# Altium schematic sheet 1.3.1_Power_board_BAT1&BAT2.SchDoc
size A4; DocumentNumber: 12; SheetNumber: 12; SheetTotal: 14
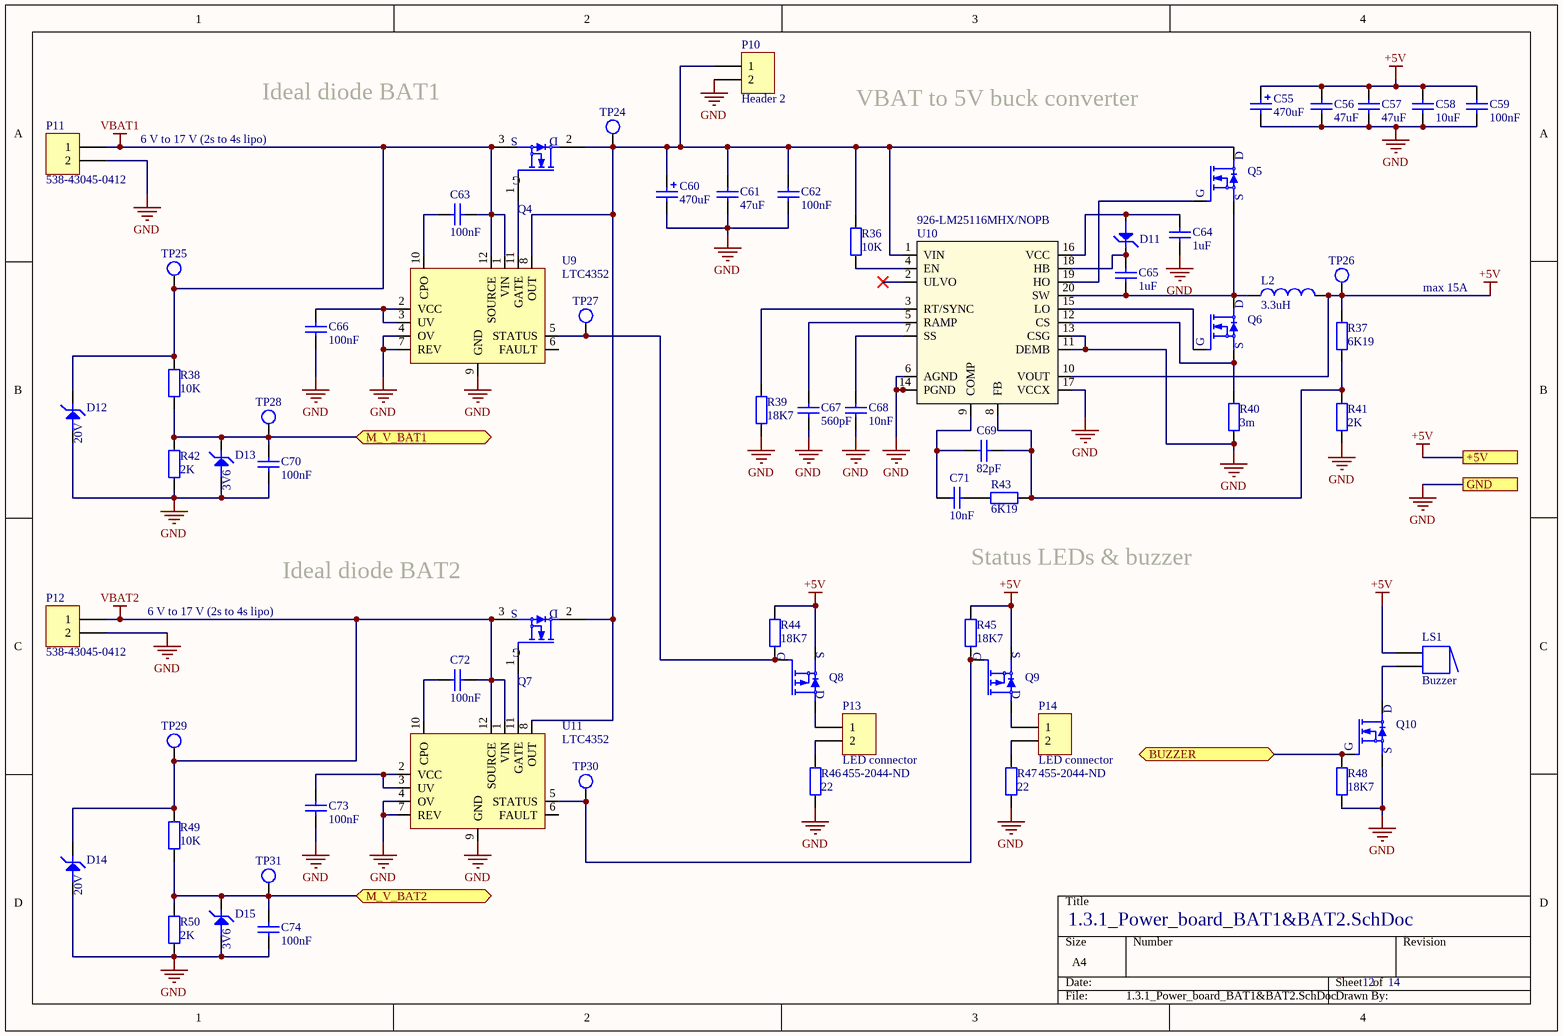
[diagram p0: 1.3.1_Power_board_BAT1&BAT2.SchDoc]

## Parts
C55  470uF  [PCV_10x10]
C56  47uF  [CAP1206W]
C57  47uF  [CAP1206W]
C58  10uF  [CAP0805W]
C59  100nF  [CAP0603R]
C60  470uF  [PCV_10x10]
C61  47uF  [CAP1206W]
C62  100nF  [CAP0603R]
C63  100nF  [CAP0603R]
C64  1uF  [CAP0603R]
C65  1uF  [CAP0603R]
C66  100nF  [CAP0603R]
C67  560pF  [CAP0603R]
C68  10nF  [CAP0603R]
C69  82pF  [CAP0603R]
C70  100nF  [CAP0603R]
C71  10nF  [CAP0603R]
C72  100nF  [CAP0603R]
C73  100nF  [CAP0603R]
C74  100nF  [CAP0603R]
D11  DS_NRVB0530T3G  [SOD123]  (value not drawn)
D12  20V  [DO-214AA]
D13  3V6  [SOT23]
D14  20V  [DO-214AA]
D15  3V6  [SOT23]
L2  3.3uH  [IHLP_Inductor]
LS1  Buzzer  [CT-1205C-SMT]
P10  Header 2  [Con Prov 2P Power]
P11  Supplier Part Number 1: 538-43045-0412  [Con 2P Power and MicroFit 4P]  (hidden comment: Header MicroFit 2)
P12  Supplier Part Number 1: 538-43045-0412  [Con 2P Power and MicroFit 4P]  (hidden comment: Header MicroFit 2)
P13  LED connector  Supplier Part Number 1: 455-2044-ND  [CON_JST_XA_ S02B-XASS-1]
P14  LED connector  Supplier Part Number 1: 455-2044-ND  [CON_JST_XA_ S02B-XASS-1]
Q4  MOSFET_N  [TO220]  (value not drawn)
Q5  MOSFET_N  [TO252]  (value not drawn)
Q6  MOSFET_N  [TO252]  (value not drawn)
Q7  MOSFET_N  [TO220]  (value not drawn)
Q8  MOSFET_P  [SOT23]  (value not drawn)
Q9  MOSFET_P  [SOT23]  (value not drawn)
Q10  MOSFET_N  [SOT-323-3]  (value not drawn)
R36  10K  [0603]
R37  6K19  [0603]
R38  10K  [0603]
R39  18K7  [0603]
R40  3m  [2010]
R41  2K  [0603]
R42  2K  [0603]
R43  6K19  [0603]
R44  18K7  [0603]
R45  18K7  [0603]
R46  22  [0603]
R47  22  [0603]
R48  18K7  [0603]
R49  10K  [0603]
R50  2K  [0603]
TP24  Test point  [TP]  (value not drawn)
TP25  Test point  [TP]  (value not drawn)
TP26  Test point  [TP]  (value not drawn)
TP27  Test point  [TP]  (value not drawn)
TP28  Test point  [TP]  (value not drawn)
TP29  Test point  [TP]  (value not drawn)
TP30  Test point  [TP]  (value not drawn)
TP31  Test point  [TP]  (value not drawn)
U9  LTC4352  [TSOP612]
U10  Supplier Part Number 1: 926-LM25116MHX/NOPB  [HTSSOP 20]  (hidden comment: LM25116MHX/NOPB)
U11  LTC4352  [TSOP612]

## Ports
+5V, BUZZER (bidir), GND, M_V_BAT1 (bidir), M_V_BAT2 (bidir)

## Nets
+5V: C55.1 C56.2 C57.2 C58.2 C59.2 L2.2 LS1.1 Q8.2(S) Q9.2(S) R37.2 R44.2 R45.2 TP26.1 U10.10(VOUT) ; port +5V
GND: C55.2 C56.1 C57.1 C58.1 C59.1 C60.2 C61.1 C62.1 C64.1 C66.1 C67.1 C68.1 C70.1 C73.1 C74.1 D12.A D13.1 D14.A D15.1 P10.2 P11.2 P12.2 Q10.2(S) R39.1 R40.1 R41.1 R42.1 R46.1 R47.1 R48.1 R50.1 U9.4(OV) U9.7(REV) U9.9(GND) U10.6(AGND) U10.11(DEMB) U10.13(CSG) U10.14(PGND) U10.17(VCCX) U10.21(EP) U11.4(OV) U11.7(REV) U11.9(GND) ; port GND
VBAT1: C63.1 D12.C P11.1 Q4.3(S) R38.2 TP25.1 U9.1(VIN) U9.12(SOURCE)
VBAT2: C72.1 D14.C P12.1 Q7.3(S) R49.2 TP29.1 U11.1(VIN) U11.12(SOURCE)
BUZZER: Q10.1(G) R48.2 ; port BUZZER
M_V_BAT1: C70.2 D13.3 R38.1 R42.2 TP28.1 ; port M_V_BAT1
M_V_BAT2: C74.2 D15.3 R49.1 R50.2 TP31.1 ; port M_V_BAT2
NetC60_1: C60.1 C61.2 C62.2 P10.1 Q4.2(D) Q5.D Q7.2(D) R36.2 TP24.1 U9.8(OUT) U10.1(VIN) U11.8(OUT)
NetC63_2: C63.2 U9.10(CPO)
NetC64_2: C64.2 D11.2 U10.16(VCC)
NetC65_1: C65.1 L2.1 Q5.S Q6.D U10.20(SW)
NetC65_2: C65.2 D11.1 U10.18(HB)
NetC66_2: C66.2 U9.2(VCC) U9.3(UV)
NetC67_2: C67.2 U10.5(RAMP)
NetC68_2: C68.2 U10.7(SS)
NetC69_1: C69.1 R37.1 R41.2 R43.2 U10.8(FB)
NetC69_2: C69.2 C71.2 U10.9(COMP)
NetC71_1: C71.1 R43.1
NetC72_2: C72.2 U11.10(CPO)
NetC73_2: C73.2 U11.2(VCC) U11.3(UV)
NetLS1_2: LS1.2 Q10.3(D)
NetP13_1: P13.1 Q8.3(D)
NetP13_2: P13.2 R46.2
NetP14_1: P14.1 Q9.3(D)
NetP14_2: P14.2 R47.2
NetQ4_1: Q4.1(G) U9.11(GATE)
NetQ5_G: Q5.G U10.19(HO)
NetQ6_G: Q6.G U10.15(LO)
NetQ6_S: Q6.S R40.2 U10.12(CS)
NetQ7_1: Q7.1(G) U11.11(GATE)
NetQ8_1: Q8.1(G) R44.1 TP27.1 U9.5(STATUS)
NetQ9_1: Q9.1(G) R45.1 TP30.1 U11.5(STATUS)
NetR36_1: R36.1 U10.4(EN)
NetR39_2: R39.2 U10.3(RT/SYNC)

Not connected (* = marked no-connect by the designer): U9 6(FAULT); U10 2(ULVO)*; U11 6(FAULT)

## Notes on the sheet
- Ideal diode BAT1
- VBAT to 5V buck converter
- 6 V to 17 V (2s to 4s lipo)
- max 15A
- (near Q7) Ideal diode BAT2
- Status LEDs & buzzer

## Library data of the parts
C55 C60 = C_pol_470uF_elec: Polarized Capacitor; Supplier 1: Mouser; Supplier Part Number 1: 647-UWT1E471MNL1S
C56 C57 C61 = C_47uF_25v_1206: Capacitor; Supplier 1: Mouser; Supplier Part Number 1: 810-C3216X5R1E476M
C58 = C_10uF_16v: Capacitor; Supplier 1: Mouser; Supplier Part Number 1: 81-GRT21BC81C106ME1L
C59 C62 C63 C66 C70 C72-C74 = C_100nF: Capacitor; Supplier 1: Mouser; Supplier Part Number 1: 81-GCG188R91H104KA1D
C64 C65 = C_1uF_50v: Capacitor; Supplier 1: Mouser; Supplier Part Number 1: 81-GRT188R61H105ME3D
C67 = C_560pF_50V: Capacitor; Supplier 1: Mouser; Supplier Part Number 1: 81-GCM1885C1H561JA6D
C68 C71 = C_10nF: Capacitor; Supplier 1: Mouser; Supplier Part Number 1: 81-GCG188R91H103KA3D
C69 = C_82pF_50V: Capacitor; Supplier 1: Mouser; Supplier Part Number 1: 81-GCM1885C1H820JA6D
D12 D14 = DZ_20V: Zener Diodes 5W 20V; Supplier 1: Mouser; Supplier Part Number 1: 833-SMBJ5357B-TP
D13 D15 = DZ_3V6_MMBZ522: Zener Diodes 3.6V 225mW; Supplier 1: Mouser; Supplier Part Number 1: 863-MMBZ5227BLT1G
L2 = L_3.3uH: Inductor; Supplier 1: Mouser; Supplier Part Number 1: 70-IHLP6767DZER3R3M1
LS1 = Buzzer_CT-1205C-SMT-TR: Magnetic Transducer Buzzer 5VDC; Supplier 1: Mouser; Supplier Part Number 1: 490-CT-1205C-SMT-TR
P10 = Header 2: Juste pour tester!!!
P11 P12 = MicroFit and other Headers 2p: Supplier 1: Mouser
P13 P14 = Header 2p JST XA 3A right angle: Supplier 1: Digi-Key
Q4 Q7 = MOSFET_IPP029N06NAKSA1: Supplier 1: Mouser; Supplier Part Number 1: 726-IPP029N06NAKSA1
Q5 Q6 = MOSFET_DMTH4007LK3-13: Supplier 1: Mouser; Supplier Part Number 1: 621-DMTH4007LK3-13
Q8 Q9 = MOSFET_P_ 20V_1.5A: MOSFET 40V P-channel Trench MOSFET SOT-23-3; Supplier 1: Mouser; Supplier Part Number 1: 771-PMV250EPEAR
Q10 = MOSFET_N_ 20V_1.4A: MOSFET N-Ch 20V 1.4A SOT-323-3; Supplier 1: Mouser; Supplier Part Number 1: 726-SP000917562
R36 R38 R49 = R_0603_01W_10K: 0.1W 10K; Supplier 1: Mouser; Supplier Part Number 1: 667-ERJ-3GEYJ103V
R37 R43 = R_0603_01W_6K2: 0.1W 6K19; Supplier 1: Mouser; Supplier Part Number 1: 667-ERJ-3EKF6191V
R39 R44 R45 R48 = R_0603_01W_18K7: 0.1W 18K7; Supplier 1: Mouser; Supplier Part Number 1: 667-ERJ-3EKF1872V
R40 = R_2010_2W_3mOhm: 2W 3mOhm; Supplier 1: Mouser; Supplier Part Number 1: 667-ERJ-MP3PF3M0U
R41 R42 R50 = R_0603_01W_2K: 0.1W 2K; Supplier 1: Mouser; Supplier Part Number 1: 667-ERJ-3EKF2001V
R46 R47 = R_0603_025W_22Ohm: 0.25W 22Ohm; LatestRevisionDate: 17-Jul-2002; LatestRevisionNote: Re-released for DXP Platform.; PackageReference: AXIAL-0.4; PackageDescription: Axial Device, Thru-Hole; 2 Leads; 0.4 in Pin Spacing; Supplier 1: Mouser; Supplier Part Number 1: 667-ERJ-PA3J220V
U10 = LM25116MHX/NOPB: WIDE RANGE SYNC BUCK; Supplier 1: Mouser
D11 = DS_NRVB0530T3G: Supplier 1: Mouser; Supplier Part Number 1: 863-NRVB0530T3G
U9 U11 = LTC4352: Supplier 1: Digi-Key; Supplier Part Number 1: LTC4352IMS#PBF-ND